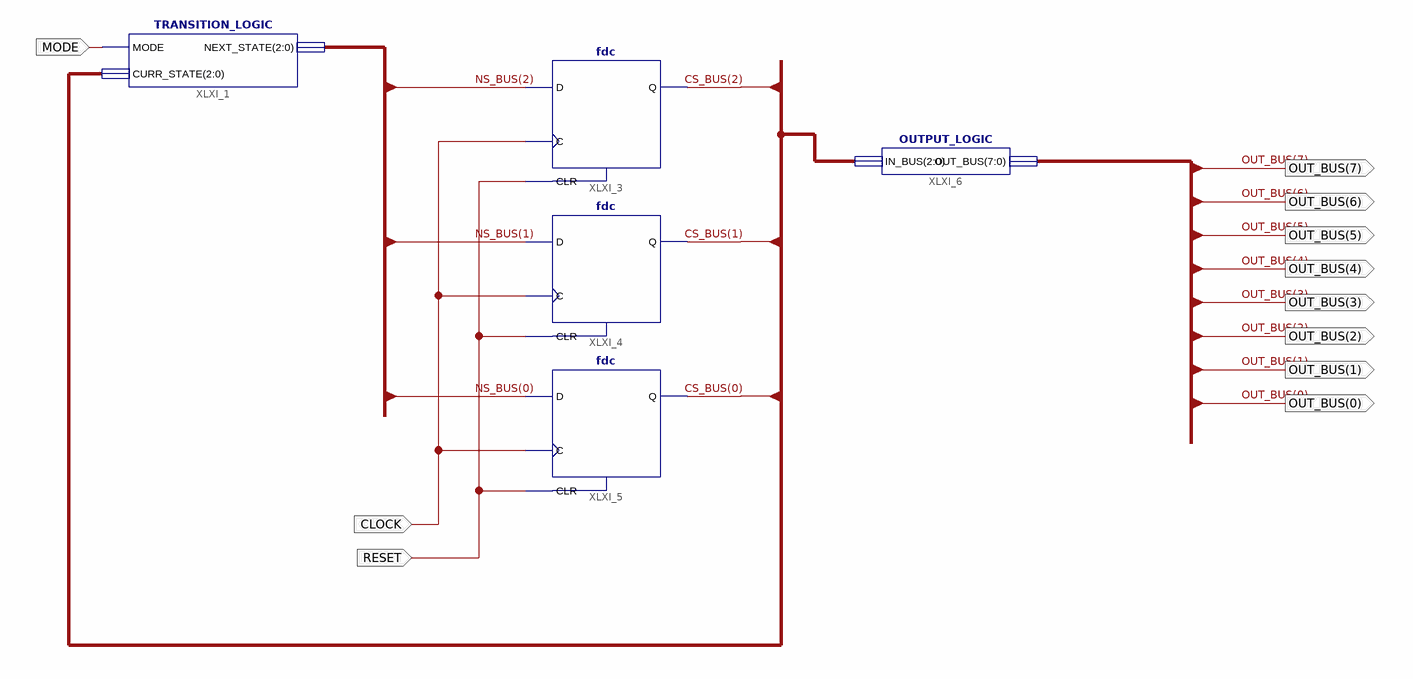
[diagram p0: schematic sheet 1]
// Xilinx ISE schematic LIGHT_CONTROLLER.sch (spartan3a) as structural Verilog: 5 symbols, 11 ports
module LIGHT_CONTROLLER (
  input  CLOCK,
  input  RESET,
  input  MODE,
  output [7:0] OUT_BUS
);

  wire [2:0] CS_BUS, NS_BUS;

  TRANSITION_LOGIC XLXI_1 (.MODE(MODE), .CURR_STATE(CS_BUS), .NEXT_STATE(NS_BUS));
  fdc XLXI_4 (.C(CLOCK), .CLR(RESET), .D(NS_BUS[1]), .Q(CS_BUS[1]));
  fdc XLXI_5 (.C(CLOCK), .CLR(RESET), .D(NS_BUS[0]), .Q(CS_BUS[0]));
  fdc XLXI_3 (.C(CLOCK), .CLR(RESET), .D(NS_BUS[2]), .Q(CS_BUS[2]));
  OUTPUT_LOGIC XLXI_6 (.IN_BUS(CS_BUS), .OUT_BUS(OUT_BUS));
endmodule
